# EasyEDA Pro project ProPrj_tang25k_YT8531C_V2.0_2026-08-23.epro, board DC12DC5
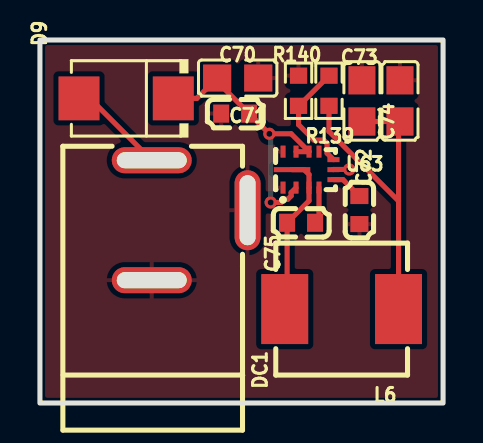
[diagram p6: board, top side]
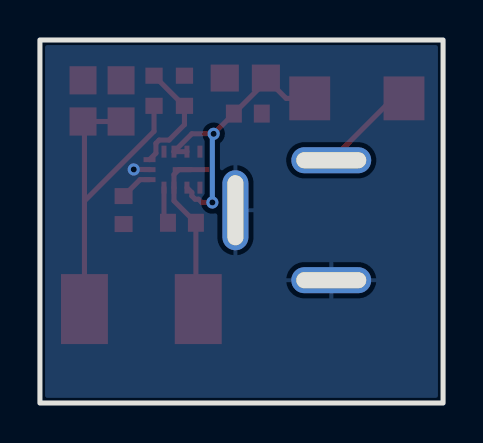
[diagram p7: board, bottom side, seen from below]

Outline 20.19 x 18.16 mm; copper layers: Top Layer, Bottom Layer. Coordinates in mm from the lower left corner of the outline.
Outline path: rectangle 0,18.16 20.19,0
Stack: Top Layer 0.035mm / Dielectric1 1.51mm FR4 er 4.5 / Bottom Layer 0.035mm

## Design rules (mm)
template: JLCPCB Capability(Two Layers Board)
spacing copperThickness1oz (default): track to track 0.102, other pairs 0.152 to 0.3
spacing copperThickness2oz: track to track 0.203, other pairs 0.152 to 0.3
track width copperThickness1oz (default): min 0.127, default 0.254, max 2.54
track width copperThickness2oz: min 0.203, default 0.254, max 2.54
differential pair differentialPair (default): width min 0.127, default 0.254, max 2.54; gap min 0.152, default 0.152
via viaSize (default): diameter min 0.5, default 0.61, max 10; hole min 0.3, default 0.305, max 6.3

## Placement (name value [footprint] x y rotation side)
C70  10uF  [C0805]  9.91 16.26 180 top
C71  220nF  [C0603]  9.78 14.48 180 top
C72  1uF  [C0603]  16 9.65 270 top
C73  22uF  [C0805]  16.13 15.11 270 top
C74  22uF  [C0805]  18.03 15.11 270 top
C75  100nF  [C0603]  13.08 9.02 180 top
D9  SS56B  [SMB_L4.6-W3.6-LS5.3-RD]  4.32 15.24 180 top
DC1  DC-005 2.0  [DC-IN-TH_DC-5520-1]  8 9.14 90 top
L6  1.5uH  [IND-SMD_L7.2-W6.6_GPSR0730]  15.11 4.7 0 top
R139  100kΩ  [R0603]  14.48 15.62 270 top
R140  24.9kΩ  [R0603]  12.95 15.62 270 top
U63  LMR33630CQRNXTQ1  [VQFN-12_L3.0-W2.0-P0.65-BL_TI_RNX]  13.44 11.67 0 top

## Footprints (pads in the part's own frame, mm; a bottom-side part is the same pattern mirrored in y, then rotated)
C0603
  rect 0.8x0.9 smd: 1(-0.7,0) 2(0.7,0)
C0805
  rect 1.41x1.35 smd: 1(-1.03,0) 2(1.03,0)
DC-IN-TH_DC-5520-1
  oval 4x1.3 hole 3.5x0.8: 2(0.5,-2.4)
  oval 1.3x4 hole 0.8x3.5: 3(-3,2.4) 4(3,2.4)
IND-SMD_L7.2-W6.6_GPSR0730
  rect 2.35x3.5 smd: 1(-2.85,0) 2(2.85,0)
R0603
  rect 0.806x0.864 smd: 1(-0.753,0) 2(0.753,0)
SMB_L4.6-W3.6-LS5.3-RD
  rect 2.047x2.192 smd: 1(-2.361,0) 2(2.361,0)
VQFN-12_L3.0-W2.0-P0.65-BL_TI_RNX
  rect 0.25x0.6 smd: 1(-1.262,-0.9) 2(-0.613,-0.9) 3(0.037,-0.9) 4(0.537,-0.9) 8(0.537,0.9) 9(0.037,0.9) 10(-0.613,0.9) 11(-1.262,0.9)
  rect 0.6x0.25 smd: 5(1.262,-0.5) 6(1.262,0) 7(1.262,0.5)
  rect 1.825x0.25 smd: 12(-0.812,0)

## Nets
As in the schematic.

Pads without a net: U63 8

## Via types
v1: diameter 0.61, hole 0.305, Top Layer to Bottom Layer, 3 vias

## Routing (per net, layer and track width the routed paths; a pad name or vN(x,y) marks a point on that pad's centre or on a via; arc(x,y) is an arc through that point)
GND: length 0.8
  Top Layer w0.254: v1(15.49,11.68) 14.71,11.68 U63.6
VCC5: length 17.5
  Top Layer w0.254: 17.96,10.1 17.96,14.01 C74.2 C73.2 ; 17.96,10.1 14.48,13.59 R139.2 ; 17.96,10.1 L6.2
VCC12: length 14.6
  Top Layer w0.254: U63.10 U63.9 12.59,13.47 v1(11.49,13.47) C71.1 8.88,16.08 C70.2 7.86,15.24 D9.1 ; U63.2 12.58,10.53 12.58,10.36 12.42,10.2 12.25,10.2 12.09,10.03 v1(11.56,10.03)
  Bottom Layer w0.254: v1(11.49,13.47) 11.56,13.4 v1(11.56,10.03)
BOOT: length 1.8
  Top Layer w0.254: U63.4 13.98,9.21 C75.1
FEEDBACK: length 5.9
  Top Layer w0.254: R139.1 12.97,14.87 R140.2 12.95,13.92 13.72,13.15 14.22,13.15 14.38,12.99 14.38,12.5 U63.7
SW: length 8.5
  Top Layer w0.254: 12.31,4.4 12.38,4.47 C75.2 13.48,10.11 U63.3 13.48,11.43 13.23,11.67 U63.12
$1N450: length 1.6
  Top Layer w0.254: U63.5 15.18,11.17 C72.1
$1N552: length 4.9
  Top Layer w0.254: D9.2 2.5,15.24 DC1.4

## Copper pours and planes (outline as drawn; the poured copper is in the pictures)
GND on Top Layer: -13.72,34.04 69.34,34.04 69.34,-13.72 -13.72,-13.72
GND on Bottom Layer: -29.21,23.11 58.8,23.11 58.8,-10.03 -29.21,-10.03
